# Altium schematic sheet UIO_Int.SchDoc: LCD Spirit Level Tester
size A; Organization: Altium Limited; Address1: L3, 12a Rodborough Rd; Address2: Frenchs Forest; Address3: NSW; Address4: Australia 2086; DocumentNumber: 2; SheetNumber: 2; SheetTotal: 3
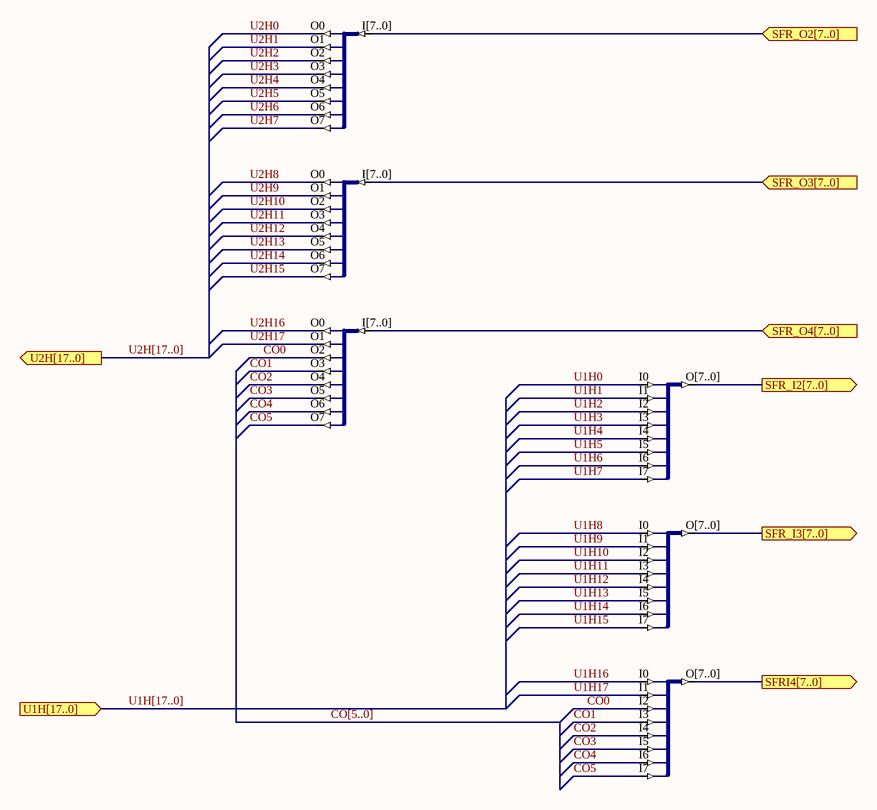
[diagram p0: UIO_Int.SchDoc]

## Parts
U1  J8B_8S  (value not drawn)
U2  J8B_8S  (value not drawn)
U3  J8B_8S  (value not drawn)
U4  J8S_8B  (value not drawn)
U5  J8S_8B  (value not drawn)
U6  J8S_8B  (value not drawn)

## Ports
SFR_I2[7..0] (out), SFR_I3[7..0] (out), SFR_O2[7..0] (in), SFR_O3[7..0] (in), SFR_O4[7..0] (in), SFRI4[7..0] (out), U1H[17..0] (in), U2H[17..0] (out)

## Nets
CO0: U3.O2 U6.I2
CO1: U3.O3 U6.I3
CO2: U3.O4 U6.I4
CO3: U3.O5 U6.I5
CO4: U3.O6 U6.I6
CO5: U3.O7 U6.I7
SFR_I2[7..0]: U4.O[7..0] ; port SFR_I2[7..0]
SFR_I3[7..0]: U5.O[7..0] ; port SFR_I3[7..0]
SFR_O2[7..0]: U1.I[7..0] ; port SFR_O2[7..0]
SFR_O3[7..0]: U2.I[7..0] ; port SFR_O3[7..0]
SFR_O4[7..0]: U3.I[7..0] ; port SFR_O4[7..0]
SFRI4[7..0]: U6.O[7..0] ; port SFRI4[7..0]
U1H0: U4.I0
U1H1: U4.I1
U1H2: U4.I2
U1H3: U4.I3
U1H4: U4.I4
U1H5: U4.I5
U1H6: U4.I6
U1H7: U4.I7
U1H8: U5.I0
U1H9: U5.I1
U1H10: U5.I2
U1H11: U5.I3
U1H12: U5.I4
U1H13: U5.I5
U1H14: U5.I6
U1H15: U5.I7
U1H16: U6.I0
U1H17: U6.I1
U2H0: U1.O0
U2H1: U1.O1
U2H2: U1.O2
U2H3: U1.O3
U2H4: U1.O4
U2H5: U1.O5
U2H6: U1.O6
U2H7: U1.O7
U2H8: U2.O0
U2H9: U2.O1
U2H10: U2.O2
U2H11: U2.O3
U2H12: U2.O4
U2H13: U2.O5
U2H14: U2.O6
U2H15: U2.O7
U2H16: U3.O0
U2H17: U3.O1

## Buses and harness runs
bus CO[5..0]
bus U1H[17..0] = port U1H[17..0]
bus U2H[17..0] = port U2H[17..0]

## Notes on the sheet
- Title
- Size:
- Date:
- A
- Number:
- Time:
- Revision:
- Sheet
- of
- File:

## Library data of the parts
U1-U3 = J8B_8S: 8-Bit input bus to 8 single pin outputs; FunctionalClass: Bus Joiner; PortSize: 8; ArchiveName: GENERIC; VHDLIB_SIM: GENERIC_LIB; Published: 29-Jan-2004; Publisher: Altium Limited; LastRevisionNo: 1.00.00; HelpURL: CR0118 FPGA Generic Library Guide.pdf#page=303; ComponentLink1URL: CR0126 FPGA Bus Joiner Resource Usage.pdf#page=27; ComponentLink1Description: Core &Resource Usage
U4-U6 = J8S_8B: 8 Single pin inputs to single 8-Bit output bus; FunctionalClass: Bus Joiner; PortSize: 8; ArchiveName: GENERIC; VHDLIB_SIM: GENERIC_LIB; Published: 29-Jan-2004; Publisher: Altium Limited; LastRevisionNo: 1.00.00; HelpURL: CR0118 FPGA Generic Library Guide.pdf#page=305; ComponentLink1URL: CR0126 FPGA Bus Joiner Resource Usage.pdf#page=28; ComponentLink1Description: Core &Resource Usage